# Altium project Elekid_MCU.PrjPcb
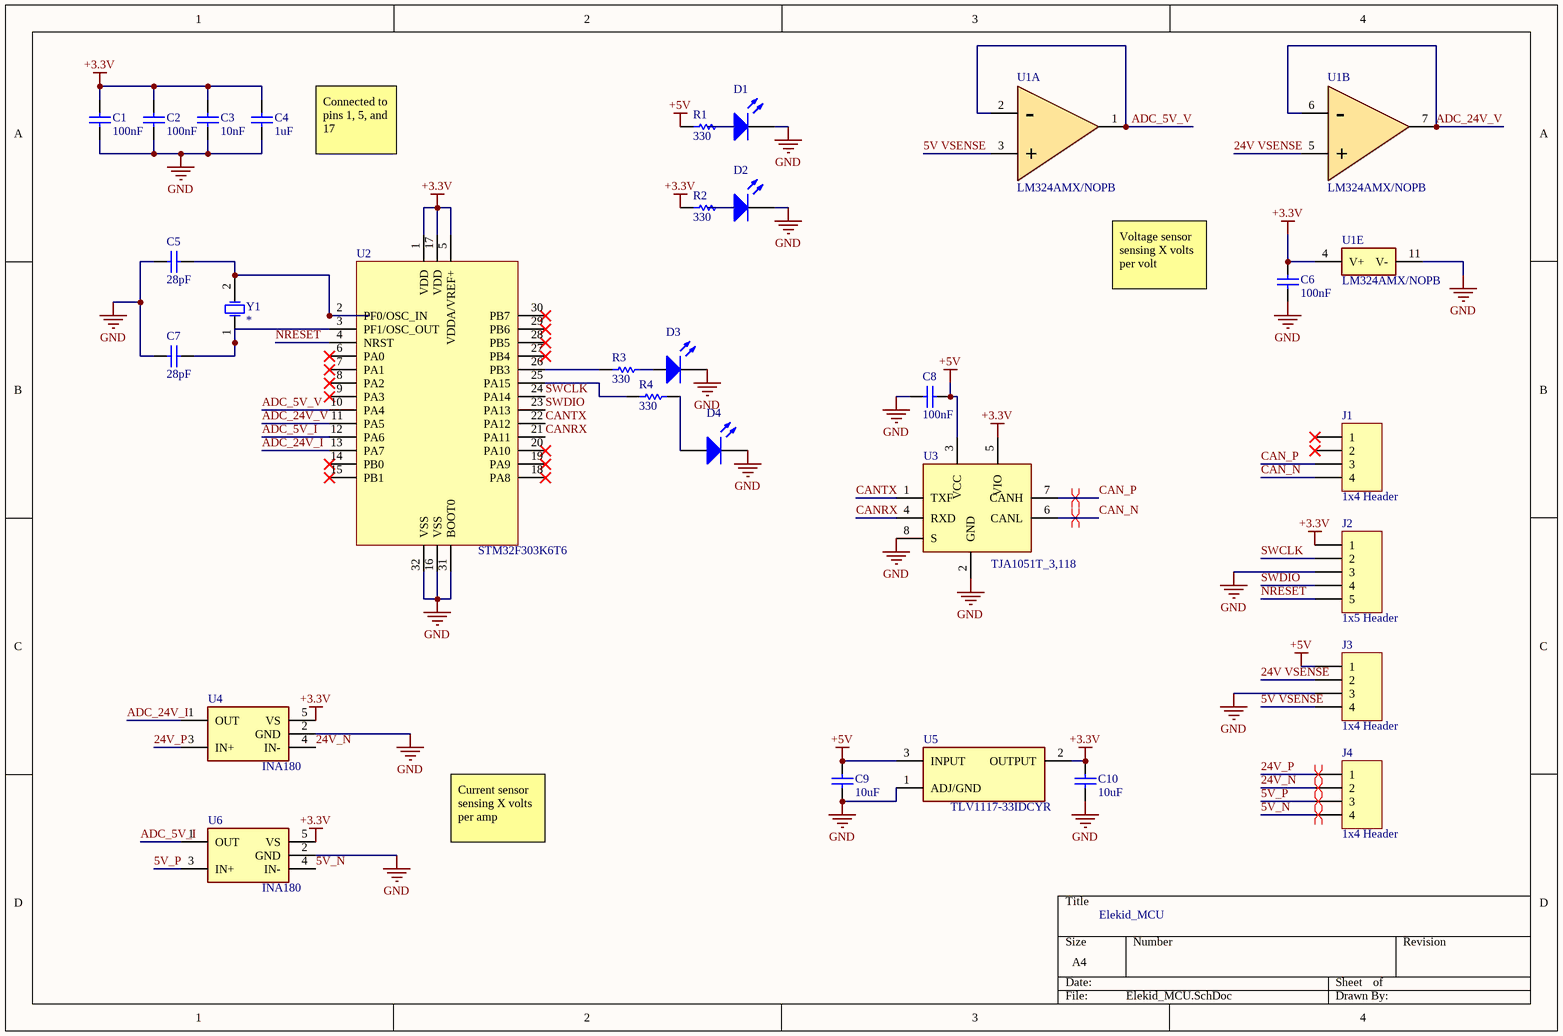
[diagram p0: Elekid_MCU.SchDoc]
1 sheet, 29 parts. Net scope: global (net labels, ports and power ports of the same name join across sheets).
Board file: Elekid_MCU.PcbDoc

## Sheet Elekid_MCU.SchDoc
size A4

### Parts
C1  value 100nF  [0805 - Capacitor]  (hidden comment: Capacitor - Nonpolarized)
C2  value 100nF  [0805 - Capacitor]  (hidden comment: Capacitor - Nonpolarized)
C3  value 10nF  [0805 - Capacitor]  (hidden comment: Capacitor - Nonpolarized)
C4  value 1uF  [0805 - Capacitor]  (hidden comment: Capacitor - Nonpolarized)
C5  value 28pF  [0805 - Capacitor]  (hidden comment: Capacitor - Nonpolarized)
C6  value 100nF  [0805 - Capacitor]  (hidden comment: Capacitor - Nonpolarized)
C7  value 28pF  [0805 - Capacitor]  (hidden comment: Capacitor - Nonpolarized)
C8  value 100nF  [0805 - Capacitor]  (hidden comment: Capacitor - Nonpolarized)
C9  value 10uF  [0805 - Capacitor]  (hidden comment: Capacitor - Nonpolarized)
C10  value 10uF  [0805 - Capacitor]  (hidden comment: Capacitor - Nonpolarized)
D1  LED  [0805 - Resistor]  (value not drawn)
D2  LED  [0805 - Resistor]  (value not drawn)
D3  LED  [0805 - Resistor]  (value not drawn)
D4  LED  [0805 - Resistor]  (value not drawn)
J1  1x4 Header  [B4B-XH]
J2  1x5 Header  [HDR1X5]
J3  1x4 Header  [B4B-XH]
J4  1x4 Header  [B4B-XH]
R1  value 330  [0603 - Resistor]  (hidden comment: Resistor)
R2  value 330  [0603 - Resistor]  (hidden comment: Resistor)
R3  value 330  [0603 - Resistor]  (hidden comment: Resistor)
R4  value 330  [0603 - Resistor]  (hidden comment: Resistor)
U1  LM324AMX/NOPB  [LM324AMX/NOPB]  (parts A,B,E of 5)
U2  STM32F303K6T6  [QFP80P900X900X160-32N]
U3  TJA1051T_3,118  [TJA1051T/3,118]
U4  INA180  [INA180]
U5  TLV1117-33IDCYR  [TLV1117]
U6  INA180  [INA180]
Y1  Oscillator  [2-SMD NO LEAD CRSYSTAL]  (value not drawn)

### Nets
+3.3V: C1.2 C2.2 C3.2 C4.2 C6.2 C10.2 J2.1 R2.1 U1.4(V+) U2.1(VDD) U2.5(VDDA/VREF+) U2.17(VDD) U3.5(VIO) U4.5(VS) U5.2(OUTPUT) U6.5(VS)
+5V: C8.2 C9.2 J3.1 R1.1 U3.3(VCC) U5.3(INPUT)
GND: C1.1 C2.1 C3.1 C4.1 C5.1 C6.1 C7.1 C8.1 C9.1 C10.1 D1.2(K) D2.2(K) D3.2(K) D4.2(K) J2.3 J3.3 U1.11(V-) U2.16(VSS) U2.31(BOOT0) U2.32(VSS) U3.2(GND) U3.8(S) U4.2(GND) U5.1(ADJ/GND) U6.2(GND)
5V VSENSE: J3.4 U1.3(+)
5V_N: J4.4 U6.4(IN-)
5V_P: J4.3 U6.3(IN+)
24V VSENSE: J3.2 U1.5(+)
24V_N: J4.2 U4.4(IN-)
24V_P: J4.1 U4.3(IN+)
ADC_5V_I: U2.12(PA6) U6.1(OUT)
ADC_5V_V: U1.1 U1.2(-) U2.10(PA4)
ADC_24V_I: U2.13(PA7) U4.1(OUT)
ADC_24V_V: U1.6(-) U1.7 U2.11(PA5)
CAN_N: J1.4 U3.6(CANL)
CAN_P: J1.3 U3.7(CANH)
CANRX: U2.21(PA11) U3.4(RXD)
CANTX: U2.22(PA12) U3.1(TXF)
NRESET: J2.5 U2.4(NRST)
SWCLK: J2.2 U2.24(PA14)
SWDIO: J2.4 U2.23(PA13)
NetC5_2: C5.2 U2.2(PF0/OSC_IN) Y1.2(OSC2)
NetC7_2: C7.2 U2.3(PF1/OSC_OUT) Y1.1(OSC1)
NetD1_1: D1.1(A) R1.2
NetD2_1: D2.1(A) R2.2
NetD3_1: D3.1(A) R3.2
NetD4_1: D4.1(A) R4.2
NetR3_1: R3.1 U2.26(PB3)
NetR4_1: R4.1 U2.25(PA15)

Not connected (* = marked no-connect by the designer): J1 1* 2*; U2 6(PA0)* 7(PA1)* 8(PA2)* 9(PA3)* 14(PB0)* 15(PB1)* 18(PA8)* 19(PA9)* 20(PA10)* 27(PB4)* 28(PB5)* 29(PB6)* 30(PB7)*

### Layout directives
differential pair: 5V_N, 5V_P, 24V_N, 24V_P, CAN_N, CAN_P

### Notes on the sheet
- Connected to pins 1, 5, and 17
- Voltage sensor sensing X volts per volt
- Current sensor sensing X volts per amp
- Elekid_MCU

### Library data of the parts
C1-C10 = Capacitor - Nonpolarized: Nonpolarized Capacitor; Supplier: *; Manufacturer: *; Rating: *; Manufacturer Part Number: *
  C1 C2 C6 C8: Supplier Part Number: 311-1140-1-ND
  C3: Supplier Part Number: 311-1136-1-ND
  C4: Supplier Part Number: 311-1886-1-ND
  C5 C7: Supplier Part Number: 1276-2622-1-ND
  C9 C10: Supplier Part Number: 490-14381-1-ND
D1-D4 = LED: Light Emitting Diode; Value: *; Manufacturer Part Number: *; Manufacturer: *; Rating: *; Supplier: *
  D1 D2: Supplier Part Number: 732-4986-1-ND
  D3: Supplier Part Number: 732-4987-1-ND
  D4: Supplier Part Number: 732-4984-1-ND
J1 J3 J4 = 1x4 Header: 1x4 Pin Header
J2 = 1x5 Header: 1x5 Pin Header
U1 = LM324AMX/NOPB: Gen Purp 4Ch Opamp
U2 = STM32F303K6T6: Integrated Circuit
U3 = TJA1051T_3,118: CAN Transceiver IC 4.5V-5.5V 250ns; Manufacturer: NXP; Datasheet: http://www.nxp.com/docs/en/data-sheet/TJA1051.pdf; Manufacturer Part Number: TJA1051T/3,118; Supplier Part Number: 568-8684-1-ND; Supplier: Digikey
U4 U6 = INA180: 0V to 26V Current Sense Amplifier; Manufacturer: Texas Instruments; Manufacturer Part Number: INA180A2IDBVR; Datasheet: https://www.ti.com/lit/ds/symlink/ina180.pdf; Supplier Part Number: 296-47653-1-ND; Supplier: Digikey
U5 = TLV1117-33IDCYR: Linear Voltage Regulator IC 3.3V 800MA SOT223-4; Manufacturer: Texas Instruments; Datasheet: http://www.ti.com/lit/ds/symlink/tlv1117.pdf?HQS=TI-null-null-digikeymode-df-pf-null-wwe&ts=1590668900314; Manufacturer Part Number: TLV1117-33IDCYR; Supplier Part Number: 296-21112-1-ND; Supplier: Digikey
Y1 = Oscillator: Crystal Oscillator; Manufacturer Part Number: *; Manufacturer: *; Supplier Part Number: 478-6970-1-ND; Supplier: *; Rating: *; Value: *
R1-R4 = Resistor: Rating: *; Manufacturer Part Number: *; Manufacturer: *; Supplier Part Number: 311-330HRCT-ND; Supplier: *